# Altium schematic sheet POWER.SchDoc
size A4; SheetNumber: 4; SheetTotal: 9
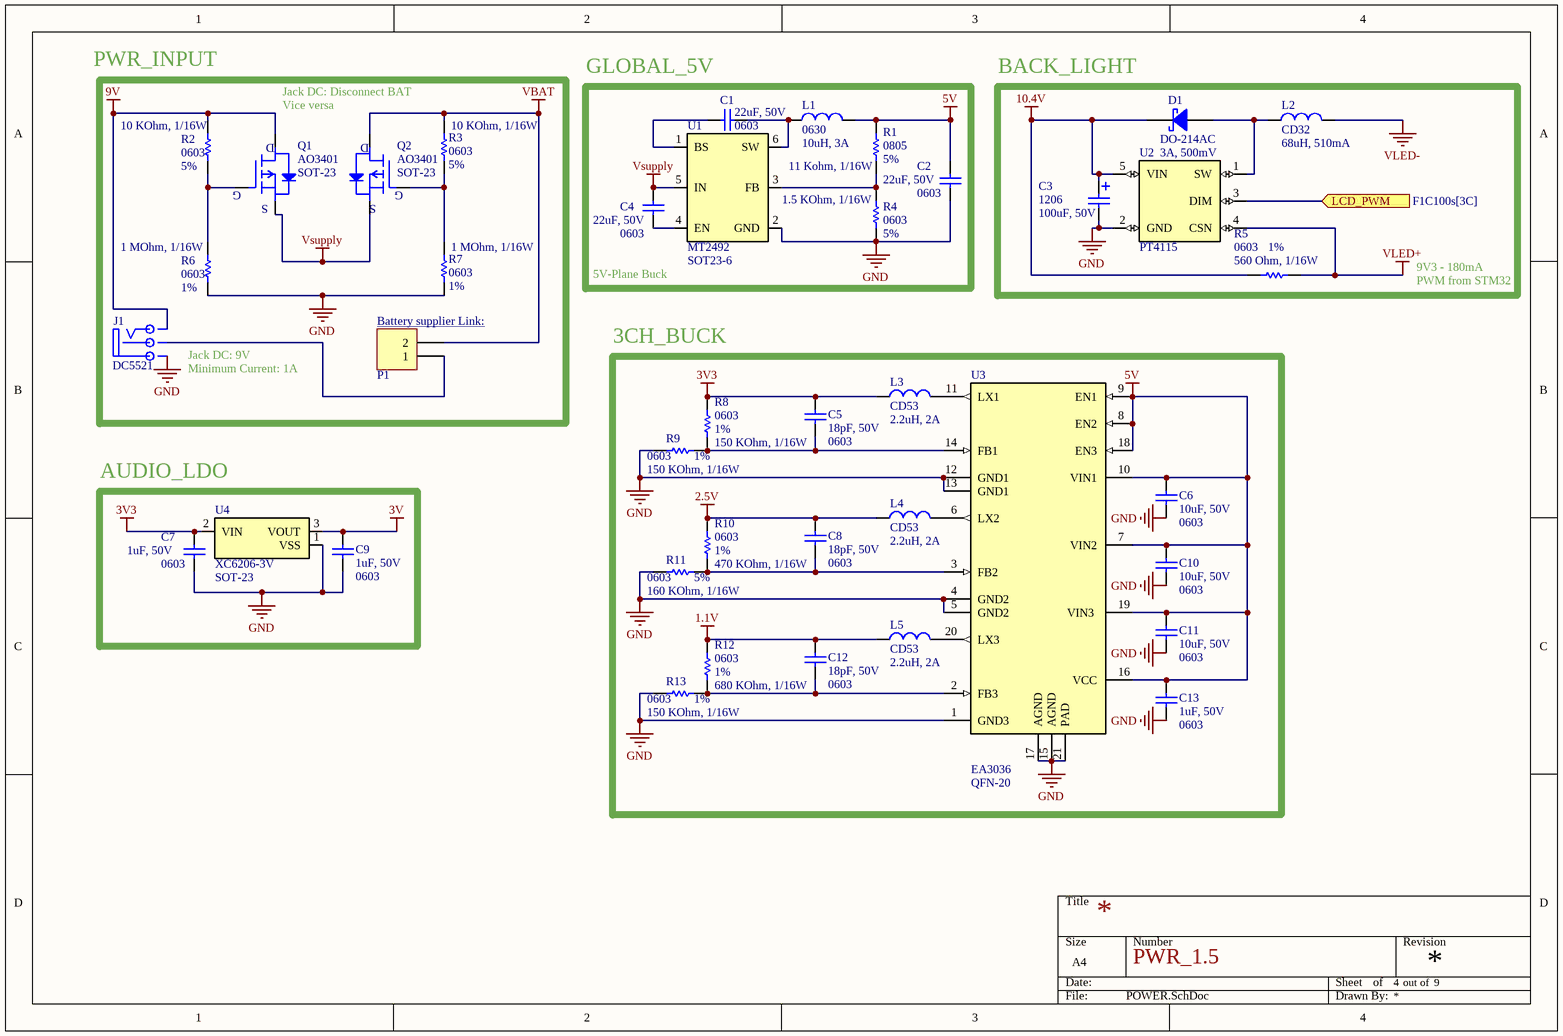
[diagram p0: POWER.SchDoc]

## Parts
C1  Package: 0603  [C_0603]  (hidden comment: 22uF, 50V)
C2  Package: 0603  [C_0603]  (hidden comment: 22uF, 50V)
C3  Package: 1206  [C_1206+]  (hidden comment: 100uF, 50V)
C4  Package: 0603  [C_0603]  (hidden comment: 22uF, 50V)
C5  Package: 0603  [C_0603]  (hidden comment: 18pF, 50V)
C6  Package: 0603  [C_0603]  (hidden comment: 10uF, 50V)
C7  Package: 0603  [C_0603]  (hidden comment: 1uF, 50V)
C8  Package: 0603  [C_0603]  (hidden comment: 18pF, 50V)
C9  Package: 0603  [C_0603]  (hidden comment: 1uF, 50V)
C10  Package: 0603  [C_0603]  (hidden comment: 10uF, 50V)
C11  Package: 0603  [C_0603]  (hidden comment: 10uF, 50V)
C12  Package: 0603  [C_0603]  (hidden comment: 18pF, 50V)
C13  Package: 0603  [C_0603]  (hidden comment: 1uF, 50V)
D1  Package: DO-214AC  [PKG_SMA (DO-214AC)]  (hidden comment: 3A, 500mV)
J1  DC5521  [CONN_DC5521]
L1  Package: 0630  [COIL_74]  (hidden comment: 10uH, 3A)
L2  Package: CD32  [COIL_CD32]  (hidden comment: 68uH, 510mA)
L3  Package: CD53  [COIL_CD53]  (hidden comment: 2.2uH, 2A)
L4  Package: CD53  [COIL_CD53]  (hidden comment: 2.2uH, 2A)
L5  Package: CD53  [COIL_CD53]  (hidden comment: 2.2uH, 2A)
P1  Header 2  [JP2]  (value not drawn)
Q1  AO3401  Package: SOT-23  [PKG_SOT-23]
Q2  AO3401  Package: SOT-23  [PKG_SOT-23]
R1  Package: 0805  Acc: 5%  [R_0805]  (hidden comment: 11 Kohm, 1/16W)
R2  Package: 0603  Acc: 5%  [R_0603]  (hidden comment: 10 KOhm, 1/16W)
R3  Package: 0603  Acc: 5%  [R_0603]  (hidden comment: 10 KOhm, 1/16W)
R4  Package: 0603  Acc: 5%  [R_0603]  (hidden comment: 1.5 KOhm, 1/16W)
R5  Package: 0603  Acc: 1%  [R_0603]  (hidden comment: 560 Ohm, 1/16W)
R6  Package: 0603  Acc: 1%  [R_0603]  (hidden comment: 1 MOhm, 1/16W)
R7  Package: 0603  Acc: 1%  [R_0603]  (hidden comment: 1 MOhm, 1/16W)
R8  Package: 0603  Acc: 1%  [R_0603]  (hidden comment: 150 KOhm, 1/16W)
R9  Package: 0603  Acc: 1%  [R_0603]  (hidden comment: 150 KOhm, 1/16W)
R10  Package: 0603  Acc: 1%  [R_0603]  (hidden comment: 470 KOhm, 1/16W)
R11  Package: 0603  Acc: 5%  [R_0603]  (hidden comment: 160 KOhm, 1/16W)
R12  Package: 0603  Acc: 1%  [R_0603]  (hidden comment: 680 KOhm, 1/16W)
R13  Package: 0603  Acc: 1%  [R_0603]  (hidden comment: 150 KOhm, 1/16W)
U1  MT2492  Package: SOT23-6  [PKG-SOT23-6]
U2  PT4115  [PKG_SOT-89-5]
U3  EA3036  Package: QFN-20  [PKG_QFN-20]
U4  XC6206-3V  Package: SOT-23  [PKG_SOT-23]

## Blocks framed on the sheet
GLOBAL_5V: C1 C2 C4 L1 R1 R4 U1
BACK_LIGHT: C3 D1 L2 R5 U2
3CH_BUCK: C5 C6 C8 C10-C13 L3-L5 R8-R13 U3
AUDIO_LDO: C7 C9 U4

## Ports
LCD_PWM (in, see F1C100s[3C])

## Nets
1.1V: C12.2 L5.1 R12.2
2.5V: C8.2 L4.1 R10.2
3V: C9.2 U4.3(VOUT)
3V3: C5.2 C7.2 L3.1 R8.2 U4.2(VIN)
5V: C2.2 C6.2 C10.2 C11.2 C13.2 L1.2 R1.2 U3.7(VIN2) U3.8(EN2) U3.9(EN1) U3.10(VIN1) U3.16(VCC) U3.18(EN3) U3.19(VIN3)
9V: J1.1(DC) Q1.3(D) R2.2
10.4V: C3.2 D1.1(K) R5.2 U2.5(VIN)
GND: C2.1 C3.1 C6.1 C7.1 C9.1 C10.1 C11.1 C13.1 J1.2(GND) R4.1 R6.1 R7.1 R9.1 R11.1 R13.1 U1.2(GND) U2.2(GND) U3.1(GND3) U3.4(GND2) U3.5(GND2) U3.12(GND1) U3.13(GND1) U3.15(AGND) U3.17(AGND) U3.21(PAD) U4.1(VSS)
VBAT: P1.2 Q2.3(D) R3.2
VLED+: R5.1 U2.4(CSN)
VLED-: L2.2
Vsupply: C4.1 Q1.2(S) Q2.2(S) U1.5(IN)
LCD_PWM: U2.3(DIM) ; port LCD_PWM
NetC1_1: C1.1 L1.1 U1.6(SW)
NetC1_2: C1.2 U1.1(BS)
NetC4_2: C4.2 U1.4(EN)
NetC5_1: C5.1 R8.1 R9.2 U3.14(FB1)
NetC8_1: C8.1 R10.1 R11.2 U3.3(FB2)
NetC12_1: C12.1 R12.1 R13.2 U3.2(FB3)
NetD1_2: D1.2(A) L2.1 U2.1(SW)
NetJ1_3: J1.3(SW) P1.1
NetL3_2: L3.2 U3.11(LX1)
NetL4_2: L4.2 U3.6(LX2)
NetL5_2: L5.2 U3.20(LX3)
NetQ1_1: Q1.1(G) R2.1 R6.2
NetQ2_1: Q2.1(G) R3.1 R7.2
NetR1_1: R1.1 R4.2 U1.3(FB)

## Notes on the sheet
- PWR_INPUT
- Jack DC: Disconnect BAT
- Vice versa
- 5V-Plane Buck
- 9V3 - 180mA
- PWM from STM32
- (near J1) Jack DC: 9V
- (near J1) Minimum Current: 1A
- (near P1) Battery supplier Link: <https://shopee.vn/product/853773489/51452518285?gads_t_sig=gqRjZGVrxHCFomtpsTE0MjUxOnRzc19zZGtfa2V5omt20QABpGFsZ2_SAAAAZKNkZWvAomN0xEAAAAAMfaLqlfFS4JwQPCoOJZHE2YMfq1tWF61pnIIHqGuyOlpkjBotHu7Xpb0YRK1tULWVZdcpI_r9hw6jgE9CqmNpcGhlcnRleHTEbgAAAAxpYQdmFFdg9CgU2G-mK0rRztpbHYYKbrkuCjYIrXlCLzFQy_a3IY-MUsDmYxsvvENVIzW7M4NS3egVLBqvh_IryX-qmnFccD5UOToMmZxT40EjX_LC0WsjmYrDKVWgjqKtHX73BWpl4ss0&gad_source=1&gad_campaignid=23034094465&gbraid=0AAAAADPpQE4KDQDxFe5mkl7NbGp-0g8MG&gclid=CjwKCAjw6f3RBhApEiwAMaCqWaqEed51TsYj482Dj91valpCY31jrgpuLpB26iR6ZSplvyDEc_oKkhoCVQkQAvD_BwE>
- PWR_1.5
- out of

## Library data of the parts
C1 C2 C4-C13 = CAP_0603: Manufacturer 1: Vishay; Manufacturer Part Number 1: CAP0603; Supplier 1: Thegioiic; Datasheet: https://www.mouser.de/datasheet/2/447/PYu_RC_Group_51_RoHS_L_11-1984063.pdf; Supplier Link: N/a
  C1 C2 C4: Value: 22uF, 50V
  C5 C8 C12: Value: 18pF, 50V
  C6 C10 C11: Value: 10uF, 50V
  C7 C9 C13: Value: 1uF, 50V
C3 = CAP+1206: Manufacturer 1: OEM; Manufacturer Part Number 1: N/a; Supplier 1: Thegioiic; Datasheet: N/a; Supplier Link: N/a; Value: 100uF, 50V
D1 = SCHOTTKY: SS34; Manufacturer 1: OEM; Manufacturer Part Number 1: N/a; ComponentLink1Description: Datasheet; ComponentLink1URL: https://www.vishay.com/doc?89055; Supplier 1: Thegioiic; Datasheet: N/a; Supplier Link: N/a; Value: 3A, 500mV
J1 = DC5521: Jack DC; Manufacturer 1: OEM; Manufacturer Part Number 1: DC5521; Supplier 1: Thegioiic; Datasheet: N/a; Supplier Link: https://www.thegioiic.com/dc5521-dau-noi-nguon-dc-cai-5521-han-pcb-kim-2-1mm
L1 = IN_0630: Manufacturer 1: OEM; Manufacturer Part Number 1: N/a; ComponentLink2Description: Supplier 1 URL; ComponentLink2URL: https://www.mouser.vn/ProductDetail/TDK/MLZ1608M100WTD25?qs=u4%252BEJ9urDATpNhOvJ54DAQ%3D%3D; ComponentLink1Description: Datasheet; ComponentLink1URL: https://product.tdk.com/system/files/dam/doc/product/inductor/inductor/smd/catalog/inductor_automotive_decoupling_mlz1608_en.pdf?ref_disty=mouser; ComponentLink3Description: Supplier 2 URL; ComponentLink3URL: https://www.digikey.com/en/products/detail/tdk-corporation/MLZ1608M100WTD25/4743176; ComponentLink4Description: Supplier 3 URL; Supplier 1: Thegioiic; Datasheet: N/a; Supplier Link: N/a; Value: 10uH, 3A
L2 = IN_CD32: Manufacturer 1: OEM; Manufacturer Part Number 1: N/a; ComponentLink2Description: Supplier 1 URL; ComponentLink2URL: https://www.mouser.vn/ProductDetail/TDK/MLZ1608DR10DTD25?qs=u4%252BEJ9urDARQOELDKhLR2A%3D%3D; ComponentLink1Description: Datasheet; ComponentLink1URL: https://product.tdk.com/system/files/dam/doc/product/inductor/inductor/smd/catalog/inductor_automotive_decoupling_mlz1608_en.pdf?ref_disty=mouser; ComponentLink3Description: Supplier 2 URL; ComponentLink3URL: https://www.digikey.com/en/products/detail/tdk-corporation/MLZ1608DR10DTD25/4743170; ComponentLink4Description: Supplier 3 URL; Supplier 1: Thegioiic; Datasheet: N/a; Supplier Link: N/a; Value: 68uH, 510mA
L3-L5 = IN_CD53: Manufacturer 1: OEM; Manufacturer Part Number 1: N/a; ComponentLink2Description: Supplier 1 URL; ComponentLink2URL: https://www.mouser.vn/ProductDetail/TDK/MLZ1608DR10DTD25?qs=u4%252BEJ9urDARQOELDKhLR2A%3D%3D; ComponentLink1Description: Datasheet; ComponentLink1URL: https://product.tdk.com/system/files/dam/doc/product/inductor/inductor/smd/catalog/inductor_automotive_decoupling_mlz1608_en.pdf?ref_disty=mouser; ComponentLink3Description: Supplier 2 URL; ComponentLink3URL: https://www.digikey.com/en/products/detail/tdk-corporation/MLZ1608DR10DTD25/4743170; ComponentLink4Description: Supplier 3 URL; Supplier 1: Thegioiic; Datasheet: N/a; Supplier Link: N/a; Value: 2.2uH, 2A
P1 = Header 2: Header, 2-Pin; LatestRevisionDate: 17-Jul-2002; LatestRevisionNote: Re-released for DXP Platform.; Publisher: Altium Limited
Q1 Q2 = AO3401: P-Channel 30 V 4A (Ta) 1.4W (Ta) Surface Mount SOT-23-3; Manufacturer 1: Alpha&Omega Semi.; Manufacturer Part Number 1: AO3401; Supplier 1: ICDayroi; Datasheet: https://www.snapeda.com/parts/AO3401/Alpha%20&%20Omega%20Semiconductor/datasheet/; Supplier Link: https://icdayroi.com/ao3401
R1 = RES_0805: Manufacturer 1: Vishay; Manufacturer Part Number 1: RES0805; Supplier 1: Thegioiic; Datasheet: https://www.mouser.de/datasheet/2/447/PYu_RC_Group_51_RoHS_L_11-1984063.pdf; Supplier Link: N/a; Value: 11 Kohm, 1/16W
R2-R13 = RES_0603: Manufacturer 1: Vishay; Manufacturer Part Number 1: RES0603; Supplier 1: Thegioiic; Datasheet: https://www.mouser.de/datasheet/2/447/PYu_RC_Group_51_RoHS_L_11-1984063.pdf; Supplier Link: N/a
  R2 R3: Value: 10 KOhm, 1/16W
  R4: Value: 1.5 KOhm, 1/16W
  R5: Value: 560 Ohm, 1/16W
  R6 R7: Value: 1 MOhm, 1/16W
  R8 R9 R13: Value: 150 KOhm, 1/16W
  R10: Value: 470 KOhm, 1/16W
  R11: Value: 160 KOhm, 1/16W
  R12: Value: 680 KOhm, 1/16W
U1 = MT2492: 600KHz, 16V，2A Synchronous / Step-Down Converter; Manufacturer 1: AEROSEMI; Manufacturer Part Number 1: MT2492; Supplier 1: linhkienthuduc; Datasheet: https://images.tuyacn.com/smart/A_TUYA/camera/MT2492.pdf; Supplier Link: https://linhkienthuduc.com/san-pham/mt2492-ic-nguon-buck-2a/?srsltid=AfmBOoqjhnkSrAs4LOHLVGH4jS9BsyeN6OqcnkH62NuZAXu-ngXV-6yD
U2 = PT4115: 0V, 1.2A Step-down High Brightness / LED Driver with 5000:1 Dimming; Manufacturer 1: PowTech; Manufacturer Part Number 1: PT4115; Supplier 1: icdayroi; Datasheet: https://www.microelectronicash.com/downloads/PT4115.pdf; Supplier Link: https://icdayroi.com/pt4115-pt4115b89e-sot-89-5
U3 = EA3036: 3CH power management IC for applications powered by one Li-Ion battery or a DC 5V adapter.; Manufacturer 1: EVER ANALOG; Manufacturer Part Number 1: EA3036; Supplier 1: KDE; Datasheet: https://w2.electrodragon.com/Chip-dat/ever-analog-dat/EA3036-dat/EA3036C-datasheet.pdf; Supplier Link: https://dientukhaidinh.com/ea3036cqbr-ea3036c-ea3036-3036-qfn-20-ic-quan-ly-nguon-pin-adapter-kde7060
U4 = XC6206-2.5V: P-Channel 30 V 4A (Ta) 1.4W (Ta) Surface Mount SOT-23-3; Manufacturer 1: TOREX; Manufacturer Part Number 1: XC6206-3V; Supplier 1: Linhkienthuduc; Datasheet: https://product.torexsemi.com/system/files/series/xc6206.pdf; Supplier Link: https://linhkienthuduc.com/san-pham/ic-nguon-xc6206p302mr-xc6206-3-0v-sot-23/?srsltid=AfmBOorr7RQMQnbRPGlXjibwErwDB5cPHz57D6ns415QwagKLeTO37D5Nio